# Altium schematic sheet analog.SchDoc
size A4
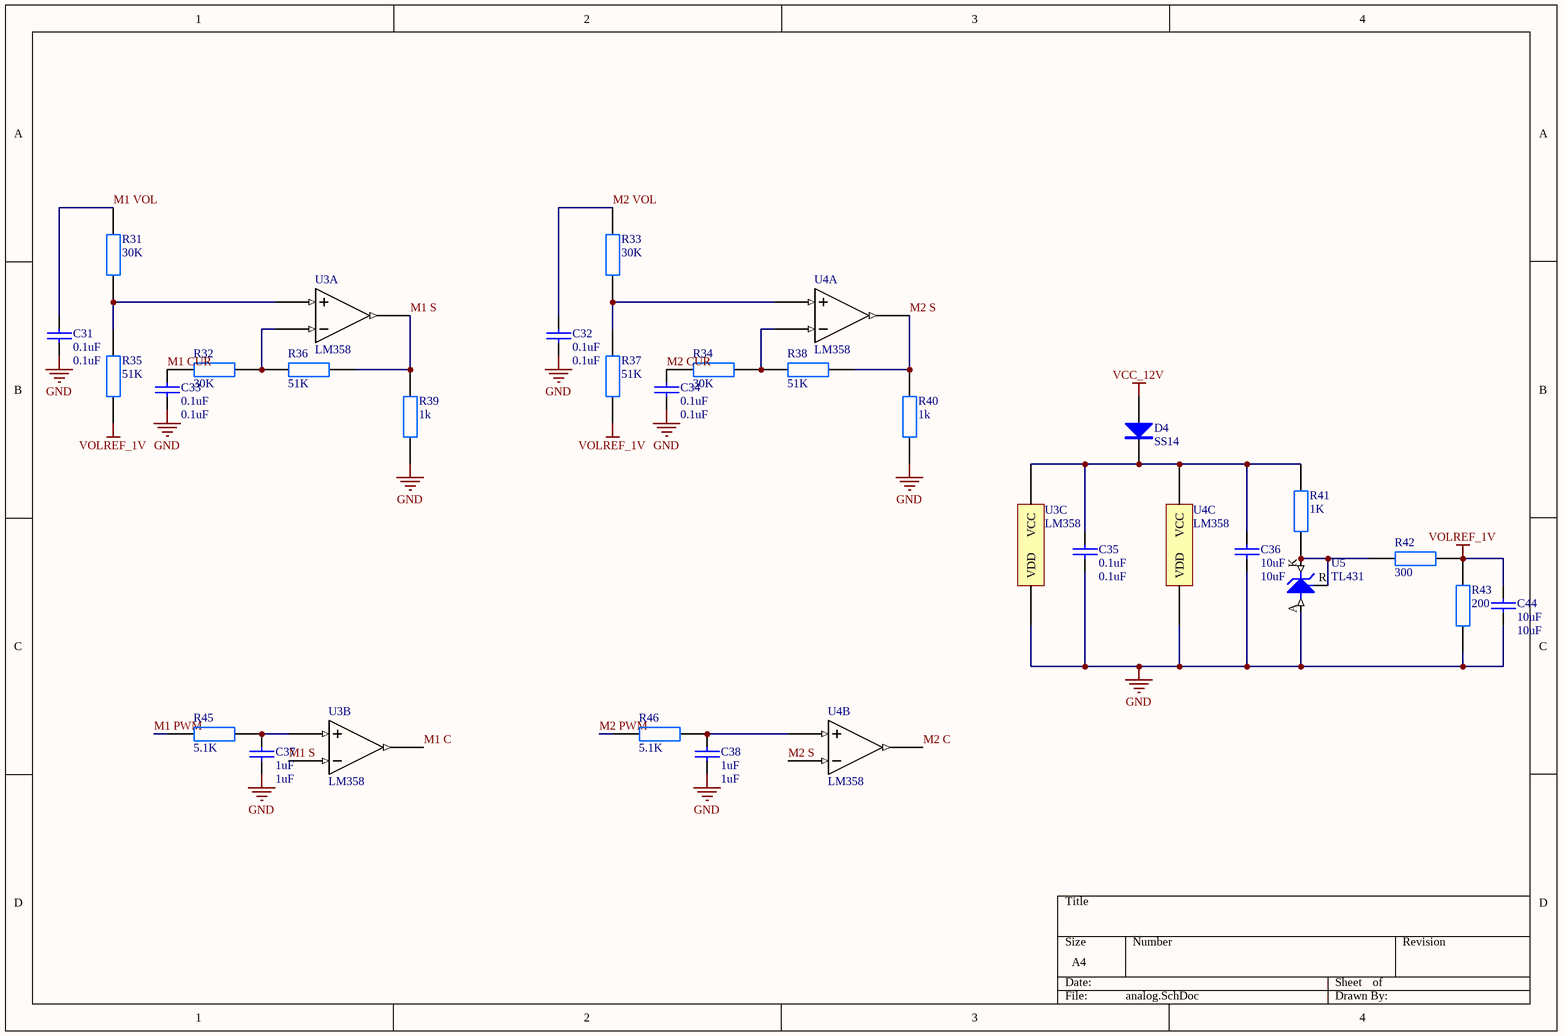
[diagram p0: analog.SchDoc]

## Parts
C31  0.1uF  [0805 CAP]
C32  0.1uF  [0805 CAP]
C33  0.1uF  [0805 CAP]
C34  0.1uF  [0805 CAP]
C35  0.1uF  [0805 CAP]
C36  10uF  [0805 CAP]
C37  1uF  [0805 CAP]
C38  1uF  [0805 CAP]
C44  10uF  [0805 CAP]
D4  SS14  [SMA]
R31  30K  [0805]
R32  30K  [0805]
R33  30K  [0805]
R34  30K  [0805]
R35  51K  [0805]
R36  51K  [0805]
R37  51K  [0805]
R38  51K  [0805]
R39  1k  [0805]
R40  1k  [0805]
R41  1K  [0805]
R42  300  [0805]
R43  200  [0805]
R45  5.1K  [0805]
R46  5.1K  [0805]
U3  LM358  [so-8]  (parts A,B,C of 3)
U4  LM358  [so-8]  (parts A,B,C of 3)
U5  TL431  [sot-23]

## Nets
GND: C31.2 C32.2 C33.2 C34.2 C35.2 C36.2 C37.2 C38.2 C44.2 R39.1 R40.1 R43.1 U3.4(VDD) U4.4(VDD) U5.A
VCC_12V: D4.1(A)
VOLREF_1V: C44.1 R35.1 R37.1 R42.1 R43.2
M1 C: U3.7
M1 CUR: C33.1 R32.2
M1 PWM: R45.1
M1 S: R36.1 R39.2 U3.1 U3.6
M1 VOL: C31.1 R31.2
M2 C: U4.7
M2 CUR: C34.1 R34.2
M2 PWM: R46.1
M2 S: R38.1 R40.2 U4.1 U4.6
M2 VOL: C32.1 R33.2
NetC35_1: C35.1 C36.1 D4.2(K) R41.2 U3.8(VCC) U4.8(VCC)
NetC37_1: C37.1 R45.2 U3.5
NetC38_1: C38.1 R46.2 U4.5
NetR31_1: R31.1 R35.2 U3.3
NetR32_1: R32.1 R36.2 U3.2
NetR33_1: R33.1 R37.2 U4.3
NetR34_1: R34.1 R38.2 U4.2
NetR41_1: R41.1 R42.2 U5.K U5.R

## Library data of the parts
C31-C38 C44 = CAP
  C31-C35: VALUE: 0.1uF
  C36 C44: VALUE: 10uF
  C37 C38: VALUE: 1uF
D4 = SS14: Diode
R31-R43 R45 R46 = RES
  R31-R34: VALUE: 30K
  R35-R38: VALUE: 51K
  R39 R40: VALUE: 1k
  R41: VALUE: 1K
  R42: VALUE: 300
  R43: VALUE: 200
  R45 R46: VALUE: 5.1K
U5 = TL431: IC; pin to pad: A>3 K>2 R>1